# Altium schematic sheet eFuse.SchDoc
size A
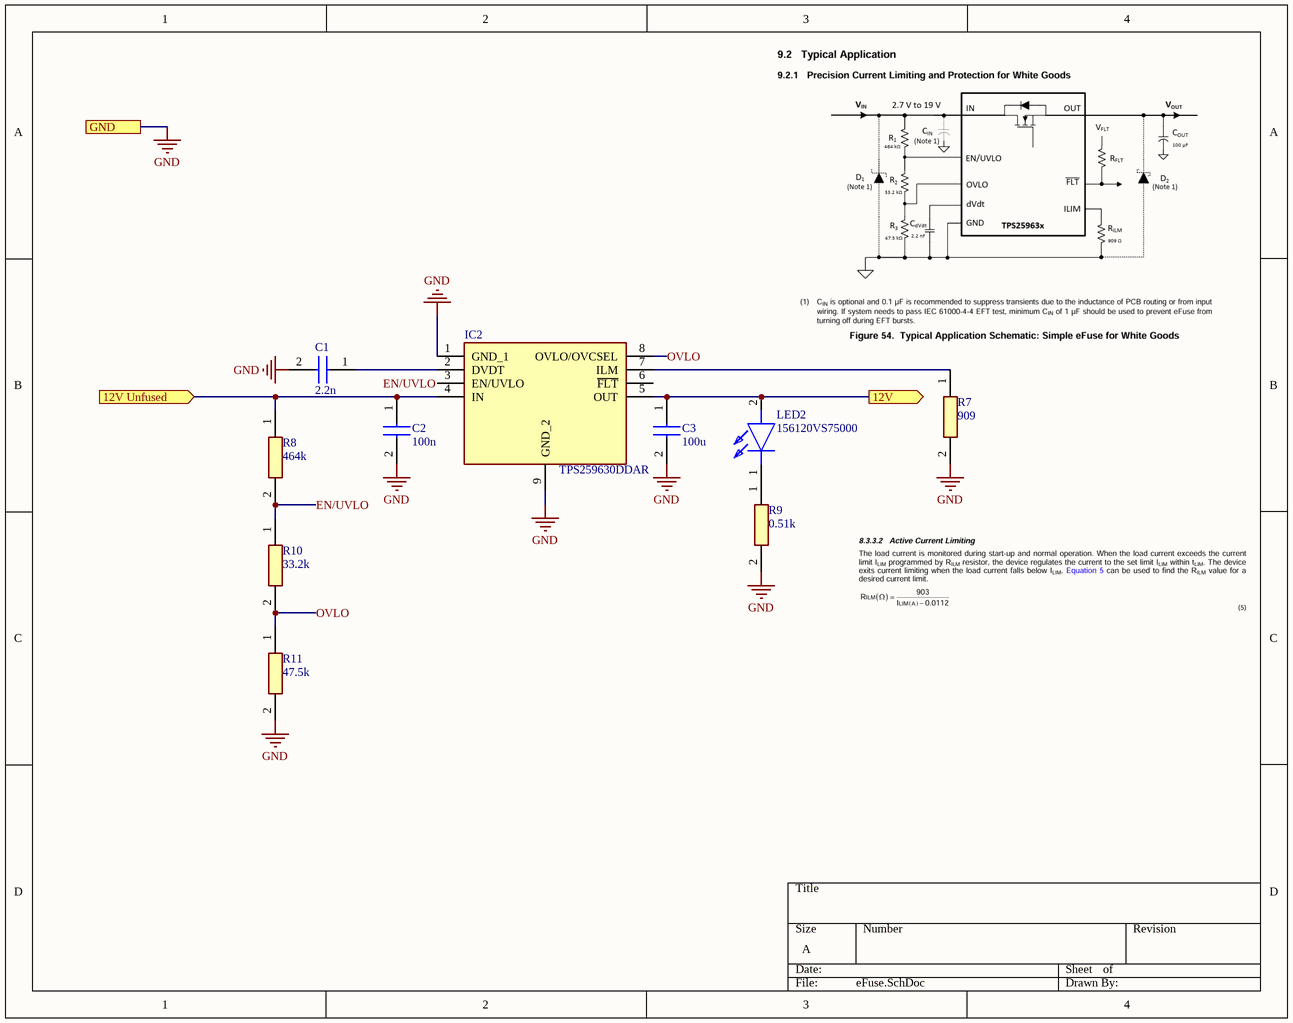
[diagram p0: eFuse.SchDoc]

## Parts
C1  2.2n  [CAPC3216X94N]
C2  100n  [CAPC3216X94N]
C3  100u  [GRM31x]
IC2  TPS259630DDAR  [SOIC127P600X170-9N]
LED2  156120VS75000  [156120VS75000]
R7  909  [ERJ8ENF1000V]
R8  464k  [RESC3216X60N]
R9  0.51k  [RESC3216X65N]
R10  33.2k  [ERJ8ENF1000V]
R11  47.5k  [ERJ8ENF1000V]

## Ports
12V (out), 12V Unfused (in), GND

## Nets
GND: C1.2(C2) C2.2 C3.2 IC2.1(GND_1) IC2.9(GND_2) R7.2 R9.2 R11.2 ; port GND
12V: C3.1 IC2.5(OUT) LED2.2(A) ; port 12V
12V Unfused: C2.1 IC2.4(IN) R8.1 ; port 12V Unfused
EN/UVLO: IC2.3(EN/UVLO) R8.2 R10.1
OVLO: IC2.8(OVLO/OVCSEL) R10.2 R11.1
NetC1_1: C1.1(C1) IC2.2(DVDT)
NetIC2_7: IC2.7(ILM) R7.1
NetLED2_1: LED2.1(K) R9.1

Not connected (* = marked no-connect by the designer): IC2 6(~{FLT})

## Library data of the parts
C1 = 1206YC222KAT2A: Capacitor; Manufacturer_Name: Kyocera AVX; Manufacturer_Part_Number: 1206YC222KAT2A; Mouser Part Number: 581-1206YC222KAT2A; Mouser Price/Stock: https://www.mouser.co.uk/ProductDetail/AVX/1206YC222KAT2A?qs=CvOUr%252B7YgU7sng%252BvNa2zXQ%3D%3D
C2 = 12065C104J4Z2A: Capacitor; Manufacturer_Name: Kyocera AVX; Datasheet Link: https://spicat.kyocera-avx.com/product/mlcc/chartview/12065C104J4Z2A/DataSheet/X7R; Height: 0.94mm; Manufacturer_Part_Number: 12065C104J4Z2A; Mouser Part Number: 581-12065C104J4Z2A; Mouser Price/Stock: https://www.mouser.com/Search/Refine.aspx?Keyword=581-12065C104J4Z2A
C3 = GRM31CR60J107KEA8L: Capacitor; Manufacturer_Name: Murata Electronics; Datasheet Link: https://search.murata.co.jp/Ceramy/image/img/A01X/G101/ENG/GRM31CR60J107KEA8-01A.pdf; Height: 1.25mm; Manufacturer_Part_Number: GRM31CR60J107KEA8L; Mouser Part Number: 81-GRM31CR60J107KE8L; Mouser Price/Stock: https://www.mouser.co.uk/ProductDetail/Murata-Electronics/GRM31CR60J107KEA8L?qs=pUKx8fyJudDzdyEEakAKPA%3D%3D
IC2 = TPS259630DDAR: Integrated Circuit; Manufacturer_Name: Texas Instruments; Datasheet Link: https://www.ti.com/lit/gpn/TPS2596; Height: 1.7mm; Manufacturer_Part_Number: TPS259630DDAR; Mouser Part Number: 595-TPS259630DDAR; Mouser Price/Stock: https://www.mouser.co.uk/ProductDetail/Texas-Instruments/TPS259630DDAR?qs=T3oQrply3y%252BCA0rOFESTyA%3D%3D; Arrow Part Number: TPS259630DDAR; Arrow Price/Stock: https://www.arrow.com/en/products/tps259630ddar/texas-instruments
LED2 = 156120VS75000: LED; Manufacturer_Name: Wurth Elektronik; Datasheet Link: https://www.we-online.com/components/products/datasheet/156120VS75000.pdf; Height: 1.3mm; Manufacturer_Part_Number: 156120VS75000; Mouser Part Number: 710-156120VS75000; Mouser Price/Stock: https://www.mouser.co.uk/ProductDetail/Wurth-Elektronik/156120VS75000?qs=2kOmHSv6VfQAUFg5BeuEfQ%3D%3D
R7 = ERJ-8ENF9090V: Resistor; Manufacturer_Name: Panasonic; Datasheet Link: https://industrial.panasonic.com/cdbs/www-data/pdf/RDA0000/AOA0000C86.pdf; Height: 0.7mm; Manufacturer_Part_Number: ERJ-8ENF9090V; Mouser Part Number: 667-ERJ-8ENF9090V; Mouser Price/Stock: https://www.mouser.co.uk/ProductDetail/Panasonic/ERJ-8ENF9090V?qs=Ow%252BOiPmaljFp7qjHXHnn0Q%3D%3D
R8 = CRCW1206464KFKEA: Resistor; Manufacturer_Name: Vishay; Datasheet Link: http://componentsearchengine.com/Datasheets/2/CRCW1206464KFKEA.pdf; Height: 0.6mm; Manufacturer_Part_Number: CRCW1206464KFKEA; Mouser Part Number: 71-CRCW1206-464K-E3; Mouser Price/Stock: https://www.mouser.co.uk/ProductDetail/Vishay-Dale/CRCW1206464KFKEA?qs=9sFvXT%252Bien0sktzQDV2mCw%3D%3D
R9 = KTR18EZPJ511: Resistor; Manufacturer_Name: ROHM Semiconductor; Datasheet Link: http://rohmfs.rohm.com/en/products/databook/datasheet/passive/resistor/chip_resistor/ktr.pdf; Height: 0.65mm; Manufacturer_Part_Number: KTR18EZPJ511; Mouser Part Number: 755-KTR18EZPJ511; Mouser Price/Stock: https://www.mouser.co.uk/ProductDetail/ROHM-Semiconductor/KTR18EZPJ511?qs=DyUWGjl%252BcVvm7MQRIM2yRQ%3D%3D
R10 = ERJ-8ENF3322V: Resistor; Manufacturer_Name: Panasonic; Datasheet Link: https://industrial.panasonic.com/cdbs/www-data/pdf/RDA0000/AOA0000C86.pdf; Height: 0.7mm; Manufacturer_Part_Number: ERJ-8ENF3322V; Mouser Part Number: 667-ERJ-8ENF3322V; Mouser Price/Stock: https://www.mouser.co.uk/ProductDetail/Panasonic/ERJ-8ENF3322V?qs=8%252BG0TiN%2FgVoP4ztf7NoJ7g%3D%3D; Arrow Part Number: ERJ-8ENF3322V; Arrow Price/Stock: https://www.arrow.com/en/products/erj-8enf3322v/panasonic
R11 = ERJ-8ENF4752V: Resistor; Manufacturer_Name: Panasonic; Datasheet Link: https://industrial.panasonic.com/cdbs/www-data/pdf/RDA0000/AOA0000C86.pdf; Height: 0.7mm; Manufacturer_Part_Number: ERJ-8ENF4752V; Mouser Part Number: 667-ERJ-8ENF4752V; Mouser Price/Stock: https://www.mouser.com/Search/Refine.aspx?Keyword=667-ERJ-8ENF4752V; Arrow Part Number: ERJ-8ENF4752V; Arrow Price/Stock: https://www.arrow.com/en/products/erj-8enf4752v/panasonic